# EAGLE design emonTx V4.0.3 (EAGLE 9.6.2)
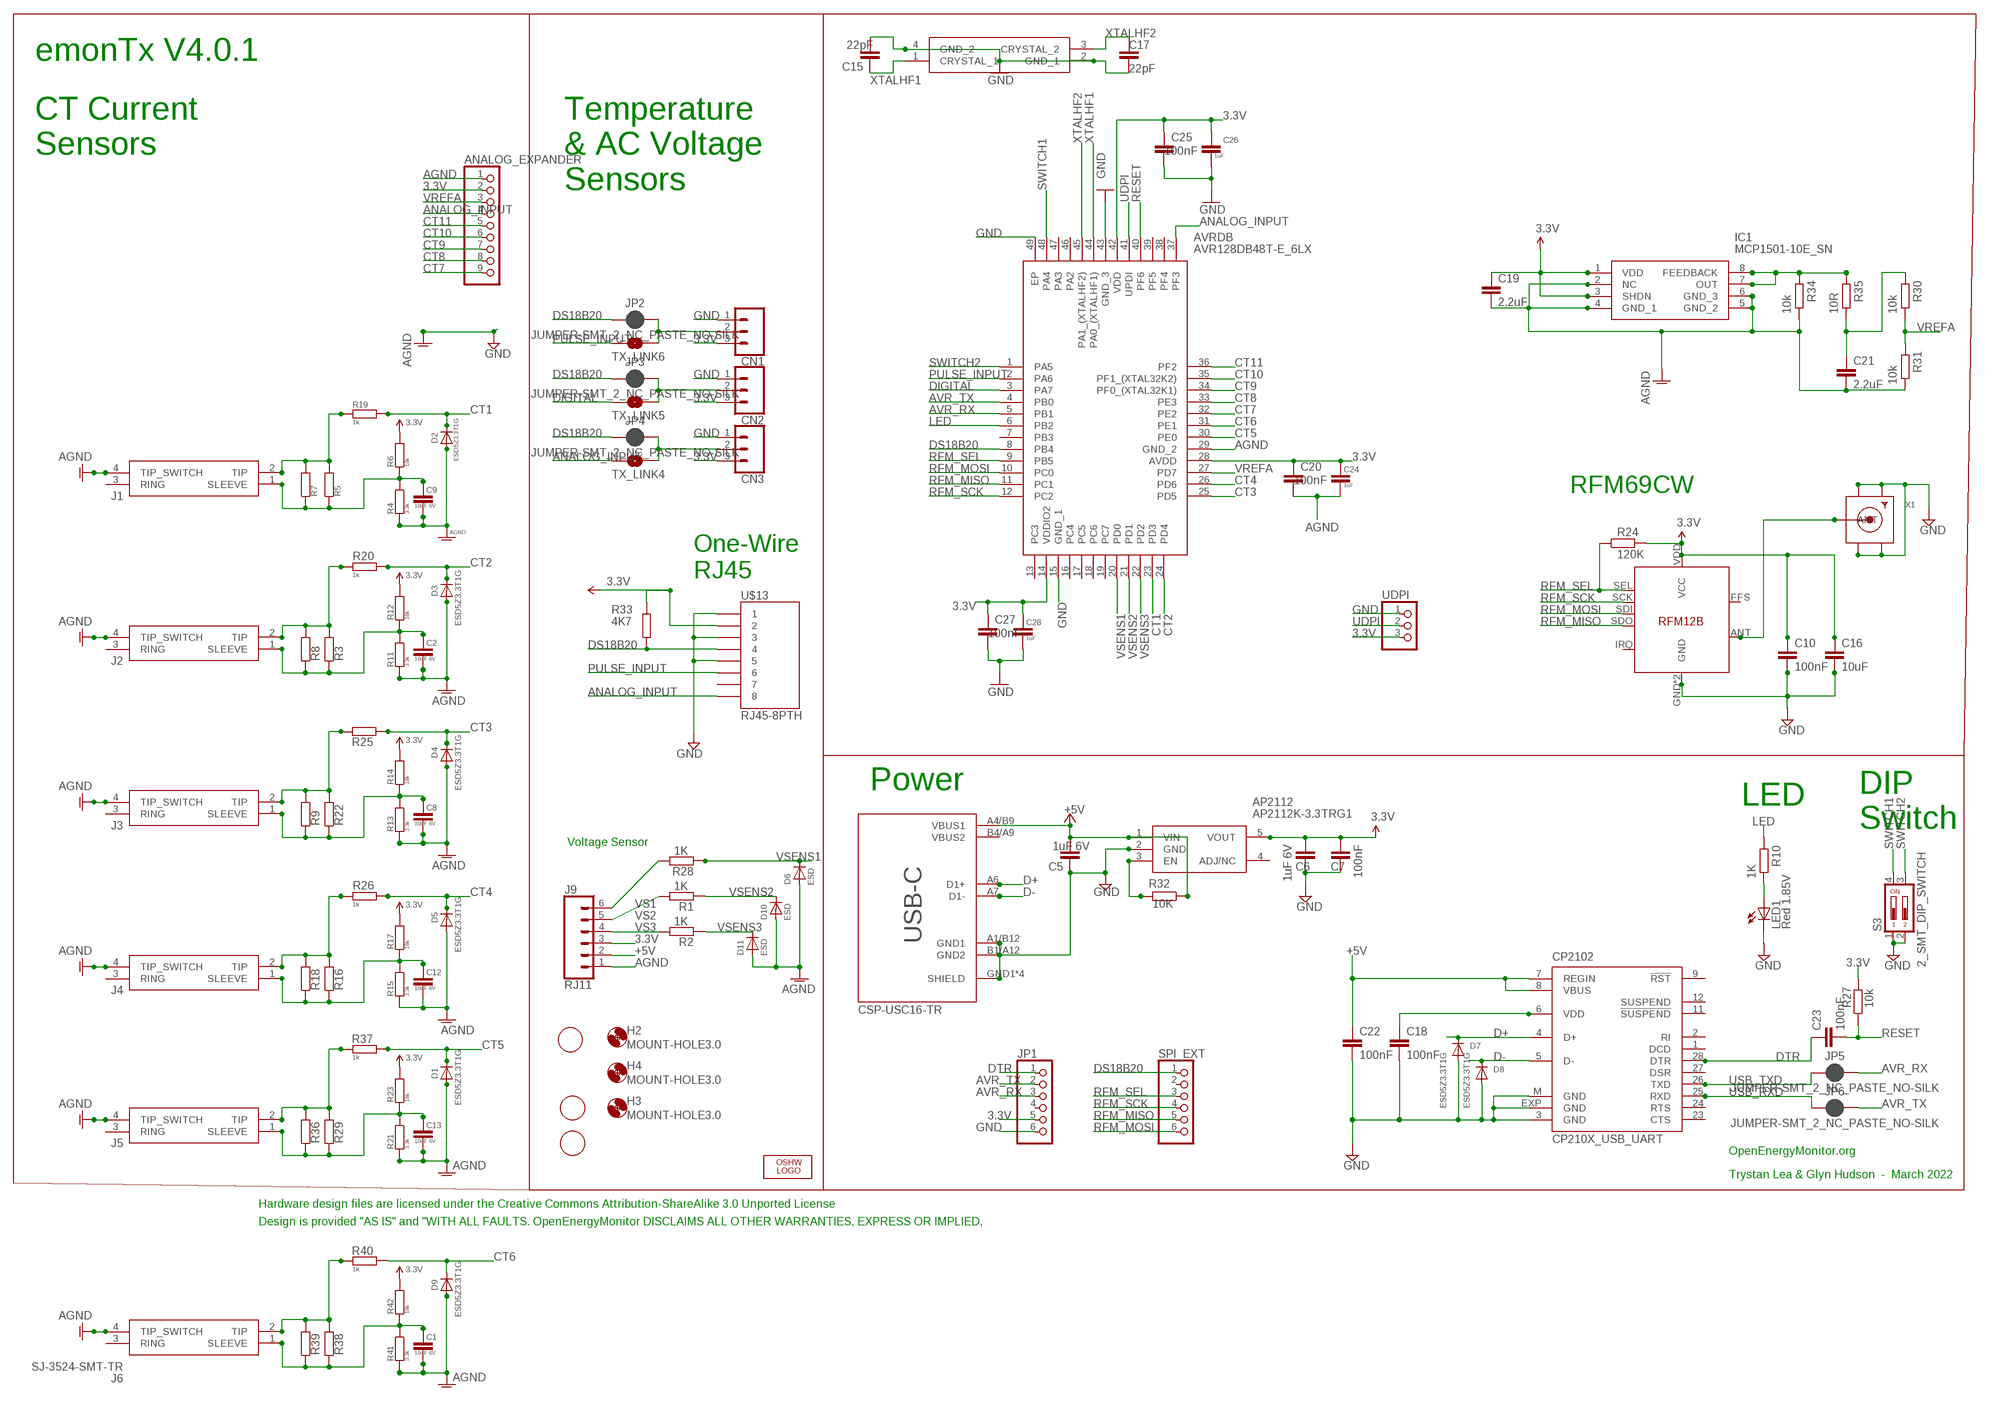
[diagram p0: schematic, sheet 1]

## Parts
ANALOG_EXPANDER  PINHD-1X9  [1X09-BIG]
AP2112  AP2112K-3.3TRG1  [SOT95P282X130-5N]
AVRDB  AVR128DB48T-E_6LX  [QFN40P600X600X90-49N]
C1  10uF 6V  C-EUC0603  [C0603]
C2  10uF 6V  C-EUC0603  [C0603]
C5  1uF 6V  C-EUC0603  [C0603]
C6  1uF 6V  C-EUC0603  [C0603]
C7  100nF  C-EUC0603  [C0603]
C8  10uF 6V  C-EUC0603  [C0603]
C9  10uF 6V  C-EUC0603  [C0603]
C10  100nF  C-EUC0603  [C0603]
C12  10uF 6V  C-EUC0603  [C0603]
C13  10uF 6V  C-EUC0603  [C0603]
C15  22pF  C-EUC0603  [C0603]
C16  10uF  C-EUC0603  [C0603]
C17  22pF  C-EUC0603  [C0603]
C18  100nF  CAP0603-CAP  [0603-CAP]
C19  2.2uF  C-EUC0603  [C0603]
C20  100nF  C-EUC0603  [C0603]
C21  2.2uF  C-EUC0603  [C0603]
C22  100nF  CAP0603-CAP  [0603-CAP]
C23  100nF  C-EUC0603  [C0603]
C24  1uF  C-EUC0603  [C0603]
C25  100nF  C-EUC0603  [C0603]
C26  1uF  C-EUC0603  [C0603]
C27  100nF  C-EUC0603  [C0603]
C28  1uF  C-EUC0603  [C0603]
CN1  CONN_03SCREW  [SCREWTERMINAL-3.5MM-3]
CN2  CONN_03SCREW  [SCREWTERMINAL-3.5MM-3]
CN3  CONN_03SCREW  [SCREWTERMINAL-3.5MM-3]
CP2102  CP210X_USB_UART  [MLP28]
D1  ESD5Z3.3T1G  DIODESOD-523  [SOD-523]
D2  ESD5Z3.3T1G  DIODESOD-523  [SOD-523]
D3  ESD5Z3.3T1G  DIODESOD-523  [SOD-523]
D4  ESD5Z3.3T1G  DIODESOD-523  [SOD-523]
D5  ESD5Z3.3T1G  DIODESOD-523  [SOD-523]
D6  ESD  DIODESOD-523  [SOD-523]
D7  ESD5Z3.3T1G  DIODESOD-523  [SOD-523]
D8  ESD5Z3.3T1G  DIODESOD-523  [SOD-523]
D9  ESD5Z3.3T1G  DIODESOD-523  [SOD-523]
D10  ESD  DIODESOD-523  [SOD-523]
D11  ESD  DIODESOD-523  [SOD-523]
H2  MOUNT-HOLE3.0  [3,0]
H3  MOUNT-HOLE3.0  [3,0]
H4  MOUNT-HOLE3.0  [3,0]
IC1  MCP1501-10E_SN  [SOIC127P600X175-8N]
J1  SJ-3524-SMT-TR  [SJ-3524-SMT-TR]
J2  SJ-3524-SMT-TR  [SJ-3524-SMT-TR]
J3  SJ-3524-SMT-TR  [SJ-3524-SMT-TR]
J4  SJ-3524-SMT-TR  [SJ-3524-SMT-TR]
J5  SJ-3524-SMT-TR  [SJ-3524-SMT-TR]
J6  SJ-3524-SMT-TR  [SJ-3524-SMT-TR]
J9  RJ11  RJ11-6  [RJ11-6]
JP1  PINHD-1X6  [1X06]
JP2  JUMPER-SMT_2_NC_PASTE_NO-SILK  [SMT-JUMPER_2_NC_PASTE_NO-SILK]
JP3  JUMPER-SMT_2_NC_PASTE_NO-SILK  [SMT-JUMPER_2_NC_PASTE_NO-SILK]
JP4  JUMPER-SMT_2_NC_PASTE_NO-SILK  [SMT-JUMPER_2_NC_PASTE_NO-SILK]
JP5  JUMPER-SMT_2_NC_PASTE_NO-SILK  [SMT-JUMPER_2_NC_PASTE_NO-SILK]
JP6  JUMPER-SMT_2_NC_PASTE_NO-SILK  [SMT-JUMPER_2_NC_PASTE_NO-SILK]
LED1  Red 1.85V  LEDCHIP-LED0805  [CHIP-LED0805]
LOGO1  OSHW_LOGO_6MILX0200-NT  [OSHW_6X200_NOTEXT]
R1  1K  R-EU_R0603  [R0603]
R2  1K  R-EU_R0603  [R0603]
R3  R-EU_0204/7  [0204/7]
R4  3.3k  R-EU_R0603  [R0603]
R5  R-EU_0204/7  [0204/7]
R6  18k  R-EU_R0603  [R0603]
R7  R-EU_R1206  [R1206]
R8  R-EU_R1206  [R1206]
R9  R-EU_R1206  [R1206]
R10  1K  R-EU_R0603  [R0603]
R11  3.3k  R-EU_R0603  [R0603]
R12  18k  R-EU_R0603  [R0603]
R13  3.3k  R-EU_R0603  [R0603]
R14  18k  R-EU_R0603  [R0603]
R15  3.3k  R-EU_R0603  [R0603]
R16  R-EU_0204/7  [0204/7]
R17  18k  R-EU_R0603  [R0603]
R18  R-EU_R1206  [R1206]
R19  1k  R-EU_R0603  [R0603]
R20  1k  R-EU_R0603  [R0603]
R21  3.3k  R-EU_R0603  [R0603]
R22  R-EU_0204/7  [0204/7]
R23  18k  R-EU_R0603  [R0603]
R24  120K  R-EU_R0603  [R0603]
R25  1k  R-EU_R0603  [R0603]
R26  1k  R-EU_R0603  [R0603]
R27  10k  R-EU_R0603  [R0603]
R28  1K  R-EU_R0603  [R0603]
R29  R-EU_0204/7  [0204/7]
R30  10k  R-EU_R0603  [R0603]
R31  10k  R-EU_R0603  [R0603]
R32  10K  R-EU_R0603  [R0603]
R33  4K7  R-EU_R0603  [R0603]
R34  10k  R-EU_R0603  [R0603]
R35  10R  R-EU_R0603  [R0603]
R36  R-EU_R1206  [R1206]
R37  1k  R-EU_R0603  [R0603]
R38  R-EU_0204/7  [0204/7]
R39  R-EU_R1206  [R1206]
R40  1k  R-EU_R0603  [R0603]
R41  3.3k  R-EU_R0603  [R0603]
R42  18k  R-EU_R0603  [R0603]
S3  2_SMT_DIP_SWITCH  [DIP_SWITCH_SMT]
SPI_EXT  PINHD-1X6  [1X06]
TX_LINK4  SOLDERJUMPERNC  [SJ_2S]
TX_LINK5  SOLDERJUMPERNC  [SJ_2S]
TX_LINK6  SOLDERJUMPERNC  [SJ_2S]
U$4  FIDUCIAL  [FIDUCIAL_1MM]
U$5  FIDUCIAL  [FIDUCIAL_1MM]
U$7  FIDUCIAL  [FIDUCIAL_1MM]
U$13  RJ45-8PTH  [RJ45-8]
U$14  RFM12B  [RFM12B]
UDPI  PINHD-1X3  [1X03]
USB-C  CSP-USC16-TR  [USB-C]
X1  SMACONNECTOR  [SMA90_DIP]
XTAL  MCSJK-7U-12.00-12-10-80-B-10  [MCSJK7U1200121080B10]

## Nets
3.3V: ANALOG_EXPANDER.2 AP2112.5(VOUT) AVRDB.14(VDDIO2) AVRDB.28(AVDD) AVRDB.42(VDD) C6.2 C7.2 C10.1 C16.1 C19.1 C20.1 C24.1 C25.1 C26.1 C27.1 C28.1 CN1.3 CN2.3 CN3.3 IC1.1(VDD) IC1.3(SHDN) J9.3 JP1.5 R6.2 R12.2 R14.2 R17.2 R23.2 R24.2 R27.2 R33.1 R42.2 U$13.2 U$14.VDD(VCC) UDPI.3
+5V [power]: AP2112.1(VIN) C5.2 C22.1 CP2102.7(REGIN) CP2102.8(VBUS) J9.2 R32.1 USB-C.A4/B9(VBUS1)
AGND [gnd]: ANALOG_EXPANDER.1 AVRDB.29(GND_2) C1.2 C2.2 C8.2 C9.2 C12.2 C13.2 C19.2 C20.2 C21.2 C24.2 D1.A D2.A D3.A D4.A D5.A D6.A D9.A D10.A D11.A IC1.2(NC) IC1.4(GND_1) IC1.5(GND_2) IC1.6(GND_3) J1.4(TIP_SWITCH) J2.4(TIP_SWITCH) J3.4(TIP_SWITCH) J4.4(TIP_SWITCH) J5.4(TIP_SWITCH) J6.4(TIP_SWITCH) J9.1 R4.2 R11.2 R13.2 R15.2 R21.2 R31.1 R34.1 R41.2
ANALOG_INPUT: ANALOG_EXPANDER.4 AVRDB.37(PF3) TX_LINK4.1 U$13.8
AVR_RX: AVRDB.5(PB1) JP1.3 JP5.2
AVR_TX: AVRDB.4(PB0) JP1.2 JP6.2
CT1: AVRDB.23(PD3) D2.K(C) R19.2
CT2: AVRDB.24(PD4) D3.K(C) R20.2
CT3: AVRDB.25(PD5) D4.K(C) R25.1
CT4: AVRDB.26(PD6) D5.K(C) R26.2
CT5: AVRDB.30(PE0) D1.K(C) R37.2
CT6: AVRDB.31(PE1) D9.K(C) R40.2
CT7: ANALOG_EXPANDER.9 AVRDB.32(PE2)
CT8: ANALOG_EXPANDER.8 AVRDB.33(PE3)
CT9: ANALOG_EXPANDER.7 AVRDB.34(PF0_(XTAL32K1))
CT10: ANALOG_EXPANDER.6 AVRDB.35(PF1_(XTAL32K2))
CT11: ANALOG_EXPANDER.5 AVRDB.36(PF2)
D+: CP2102.4(D+) D7.K(C) USB-C.A6(D1+)
D-: CP2102.5(D-) D8.K(C) USB-C.A7(D1-)
DIG1: U$14.ANT X1.ANTENNA(ANT)
DIGITAL: AVRDB.3(PA7) TX_LINK5.1
DS18B20: AVRDB.8(PB4) JP2.1 JP3.1 JP4.1 R33.2 SPI_EXT.1 U$13.4
DTR: C23.1 CP2102.28(DTR) JP1.1
GND [gnd]: AP2112.2(GND) AVRDB.15(GND_1) AVRDB.43(GND_3) AVRDB.49(EP) C5.1 C6.1 C7.1 C10.2 C15.2 C16.2 C17.2 C18.2 C22.2 C25.2 C26.2 C27.2 C28.2 CN1.1 CN2.1 CN3.1 CP2102.3(GND) CP2102.EXP(GND) CP2102.M(GND) D7.A D8.A JP1.6 LED1.C S3.1 S3.2 U$13.1 U$13.3 U$13.5 U$14.GND U$14.P$12(GND) UDPI.1 USB-C.A1/B12(GND1) USB-C.B1/A12(GND2) USB-C.GND1(SHIELD) USB-C.GND2(SHIELD) USB-C.GND3(SHIELD) USB-C.GND4(SHIELD) X1.GND1 X1.GND2 X1.GND3 X1.GND4 XTAL.2(GND_1) XTAL.4(GND_2) ; supply symbol labelled AGND
LED: AVRDB.6(PB2) R10.2
N$1: AP2112.3(EN) R32.2
N$2: J6.2(TIP) R38.2 R39.2 R40.1
N$3: J3.2(TIP) R9.2 R22.2 R25.2
N$4: C18.1 CP2102.6(VDD)
N$5: C1.1 J6.1(SLEEVE) R38.1 R39.1 R41.1 R42.1
N$6: C21.1 R30.2 R35.1
N$8: J4.2(TIP) R16.2 R18.2 R26.1
N$10: J1.2(TIP) R5.2 R7.2 R19.1
N$11: C9.1 J1.1(SLEEVE) R4.1 R5.1 R6.1 R7.1
N$12: J5.2(TIP) R29.2 R36.2 R37.1
N$13: J2.2(TIP) R3.2 R8.2 R20.1
N$18: CN1.2 JP2.2 TX_LINK6.2
N$19: CN2.2 JP3.2 TX_LINK5.2
N$21: CN3.2 JP4.2 TX_LINK4.2
N$24: C2.1 J2.1(SLEEVE) R3.1 R8.1 R11.1 R12.1
N$25: C8.1 J3.1(SLEEVE) R9.1 R13.1 R14.1 R22.1
N$26: C12.1 J4.1(SLEEVE) R15.1 R16.1 R17.1 R18.1
N$27: IC1.7(OUT) IC1.8(FEEDBACK) R34.2 R35.2
N$28: C13.1 J5.1(SLEEVE) R21.1 R23.1 R29.1 R36.1
N$41: LED1.A R10.1
PULSE_INPUT: AVRDB.2(PA6) TX_LINK6.1 U$13.6
RESET: AVRDB.40(PF6) C23.2 R27.1
RFM_MISO: AVRDB.11(PC1) SPI_EXT.5 U$14.SDO
RFM_MOSI: AVRDB.10(PC0) SPI_EXT.6 U$14.SDI
RFM_SCK: AVRDB.12(PC2) SPI_EXT.4 U$14.SCK
RFM_SEL: AVRDB.9(PB5) R24.1 SPI_EXT.3 U$14.SEL
SWITCH1: AVRDB.48(PA4) S3.4
SWITCH2: AVRDB.1(PA5) S3.3
UDPI: AVRDB.41(UPDI) UDPI.2
USB_RXD: CP2102.25(RXD) JP6.1
USB_TXD: CP2102.26(TXD) JP5.1
VREFA: ANALOG_EXPANDER.3 AVRDB.27(PD7) R30.1 R31.2
VS1: J9.6 R28.2
VS2: J9.5 R1.2
VS3: J9.4 R2.2
VSENS1: AVRDB.20(PD0) D6.K(C) R28.1
VSENS2: AVRDB.21(PD1) D10.K(C) R1.1
VSENS3: AVRDB.22(PD2) D11.K(C) R2.1
XTALHF1: AVRDB.44(PA0_(XTALHF1)) C15.1 XTAL.1(CRYSTAL_1)
XTALHF2: AVRDB.45(PA1_(XTALHF2)) C17.1 XTAL.3(CRYSTAL_2)
Unconnected: AP2112.4(ADJ/NC) AVRDB.7(PB3) AVRDB.13(PC3) AVRDB.16(PC4) AVRDB.17(PC5) AVRDB.18(PC6) AVRDB.19(PC7) AVRDB.38(PF4) AVRDB.39(PF5) AVRDB.46(PA2) AVRDB.47(PA3) CP2102.1(DCD) CP2102.2(RI) CP2102.9(!RST) CP2102.11(!SUSPEND) CP2102.12(SUSPEND) CP2102.23(CTS) CP2102.24(RTS) CP2102.27(DSR) J1.3(RING) J2.3(RING) J3.3(RING) J4.3(RING) J5.3(RING) J6.3(RING) JP1.4 SPI_EXT.2 U$13.7 U$14.FFS U$14.IRQ USB-C.B4/A9(VBUS2)

## Notes on the sheet
- emonTx V4.0.1
- CT Current 
  Sensors
- Temperature 
  & AC Voltage
  Sensors
- RFM69CW
- One-Wire
  RJ45
- Power
- LED
- DIP
  Switch
- Voltage Sensor
- OpenEnergyMonitor.org
- Trystan Lea & Glyn Hudson  -  March 2022
- Hardware design files are licensed under the Creative Commons Attribution-ShareAlike 3.0 Unported License
- Design is provided "AS IS" and "WITH ALL FAULTS. OpenEnergyMonitor DISCLAIMS ALL OTHER WARRANTIES, EXPRESS OR IMPLIED,

## Library data of the parts
ANALOG_EXPANDER = adafruit:PINHD-1X9: Pin header 1x10 0.1" spacing With round pins
AP2112 = AP2112K-3.3TRG1:AP2112K-3.3TRG1: 600mA 3.3V LDO Regulator Enable SOT23-5 DiodesZetex AP2112K-3.3TRG1, LDO Voltage Regulator, 3.3 V +/-1.5%, 2.5 6 Vin, 5-Pin SOT-23 Source: Datasheet <http://uk.rs-online.com/web/p/products/8283509>; ARROW_PART_NUMBER: AP2112K-3.3TRG1; ARROW_PRICE-STOCK: https://www.arrow.com/en/products/ap2112k-3.3trg1/diodes-incorporated?region=nac; DESCRIPTION: 600mA 3.3V LDO Regulator Enable SOT23-5 DiodesZetex AP2112K-3.3TRG1, LDO Voltage Regulator, 3.3 V +/-1.5%, 2.5 6 Vin, 5-Pin SOT-23; HEIGHT: 1.3mm; MANUFACTURER_NAME: Diodes Inc.; MANUFACTURER_PART_NUMBER: AP2112K-3.3TRG1; MOUSER_PART_NUMBER: 621-AP2112K-3.3TRG1; MOUSER_PRICE-STOCK: https://www.mouser.co.uk/ProductDetail/Diodes-Incorporated/AP2112K-33TRG1?qs=x6A8l6qLYDDPYHosCdzh%2FA%3D%3D
AVRDB = AVR128DB48T-E_6LX:AVR128DB48T-E_6LX: IC MCU 8BIT 128KB FLASH 48VQFN Source: Datasheet <https://4donline.ihs.com/images/VipMasterIC/IC/MCHP/MCHP-S-A0010410415/MCHP-S-A0011111973-1.pdf?hkey=6D3A4C79FDBF58556ACFDE234799DDF0>; DESCRIPTION: IC MCU 8BIT 128KB FLASH 48VQFN; HEIGHT: 0.9mm; MANUFACTURER_NAME: Microchip; MANUFACTURER_PART_NUMBER: AVR128DB48T-E/6LX; MOUSER_PART_NUMBER: 579-VR128DB48T-E/6LX; MOUSER_PRICE-STOCK: https://www.mouser.co.uk/ProductDetail/Microchip-Technology/AVR128DB48T-E-6LX?qs=vmHwEFxEFR%252BvecSHjxOfmQ%3D%3D
C1 C2 C5-C9 C12 C13 C15 C17 C20 C24-C28 = resistor:C-EU: CAPACITOR, European symbol
C10 C16 C19 C21 C23 = rcl:C-EU: CAPACITOR, European symbol
C18 C22 = SparkFun:CAP: Capacitor Standard 0603 ceramic capacitor, and 0.1" leaded capacitor.
CN1-CN3 = SparkFun-Connectors:CONN_03: Multi connection point. Often used as Generic Header-pin footprint for 0.1 inch spaced/style header connections On any of the 0.1 inch spaced packages, you can populate with these: Break Away Headers - Straight <https://www.sparkfun.com/products/116> (PRT-00116) Break Away Male Headers - Right Angle <https://www.sparkfun.com/products/553> (PRT-00553) Female Headers <https://www.sparkfun.com/products/115> (PRT-00115) Break Away Headers - Machine Pin <https://www.sparkfun.com/products/117> (PRT-00117) Break Away Female Headers - Swiss Machine Pin <https://www.sparkfun.com/products/743> (PRT-00743) Stackable Header - 3 Pin (Female, 0.1") <https://www.sparkfun.com/products/13875> (PRT-13875) For SCREWTERMINALS and SPRING TERMINALS visit here: Screw Terimnals on SparkFun.com <https://www.sparkfun.com/search/results?term=Screw+Terminals> (5mm/3.5mm/2.54mm spacing) This device is also useful as a general connection point to wire up your design to another part of your project. Our various solder wires solder well into these plated through hole pads. Hook-Up Wire - Assortment (Stranded, 22 AWG) <https://www.sparkfun.com/products/11375> (PRT-11375) Hook-Up Wire - Assortment (Solid Core, 22 AWG) <https://www.sparkfun.com/products/11367> (PRT-11367) View the entire wire category on our website here <https://www.sparkfun.com/categories/141> Special notes: Molex polarized connector foot print use with SKU : PRT-08232 with associated crimp pins and housings.; PROD_ID: CONN-08288; SF_ID: PRT-08235
CP2102 = SparkFun-DigitalIC:CP210X_USB_UART: Single-Chip USB to UART Bridge Source: www.silabs.com .. CP2101.pdf / cp2102.pdf. Spark Fun Electronics SKU : COM-00310
D1-D11 = microbuilder:DIODE: Diode SMA Model Volts Amps Type Vf Vr Digikey # Notes SSA34-E3 40V 3A Schottky 480mV @ 3A 200uA @ 40V SSA34-E3/61TGITR-ND CDBA120-G 20V 1A Schottky 500mV @ 1A 500uA @ 20V 641-1014-6-ND REEL MBRA210 10V 2A Schottky 350mV @ 2A 700uA @ 10V MBRA210LT3 SOD-123 Model Volts Amps Type Vf Vr Order # Notes BAT54T1G 30V 200mA Schottky 800mV @ 200mA 2uA @ 25V BAT54T1GOSTR-ND B0530W 30V 500mA Schottky 430mV @ 500mA 130uA @ 30V B0530W-FDICT-ND REEL MBR120 1A 20V Schottky 340mV @ 1A MBR120VLSFT1GOSCT-ND SOD-323 Model Volts Amps Type Vf Vr Order # Notes PMEG2005EJ 20V 500mA Schottky 355mV @ 500mA 568-4110-1-ND ZLLS410 10V 570mA Schottky 380mV @ 570mA ZLLS410CT-ND 1N4148WS 75V 150mA Silicon/Simple 1V 1N4148WSFSCT-ND REEL SOD-523 Model Volts Amps Type Vf Vr Order # Notes BAT54XV2 30V 200mA Schottky 0.8V @ 100mA BAT54XV2CT-ND TB751S 30V 30mA Schottky RB751S-40TE61CT-ND SOT23-R/W (R = Solder Paste/Reflow Ovens, W = Hand-Soldering) Model Volts Amps Type Vf Vr Order # Notes BAT54FILM 40V 300mA Schottky 497-7162-1-ND
H2-H4 = holes:MOUNT-HOLE: MOUNTING HOLE with drill center marker
IC1 = MCP1501-10E_SN:MCP1501-10E_SN: MICROCHIP - MCP1501-10E/SN - VOLTAGE REF, SERIES, 1.024V, NSOIC-8 Source: Datasheet <http://www.farnell.com/datasheets/2015662.pdf>; ARROW_PART_NUMBER: MCP1501-10E/SN; ARROW_PRICE-STOCK: https://www.arrow.com/en/products/mcp1501-10esn/microchip-technology; DESCRIPTION: MICROCHIP - MCP1501-10E/SN - VOLTAGE REF, SERIES, 1.024V, NSOIC-8; HEIGHT: 1.75mm; MANUFACTURER_NAME: Microchip; MANUFACTURER_PART_NUMBER: MCP1501-10E/SN; MOUSER_PART_NUMBER: 579-MCP1501-10E/SN; MOUSER_PRICE-STOCK: https://www.mouser.co.uk/ProductDetail/Microchip-Technology/MCP1501-10E-SN?qs=BA62vJVifGrukY%252BvRXgfwQ%3D%3D
J1-J6 = SJ-3524-SMT-TR:SJ-3524-SMT-TR: Phone Connectors Audio Jacks Source: Datasheet <https://datasheet.datasheetarchive.com/originals/distributors/Datasheets-DGA1/151896.pdf>; ARROW_PART_NUMBER: SJ-3524-SMT-TR; ARROW_PRICE-STOCK: https://www.arrow.com/en/products/sj-3524-smt-tr/cui-devices?region=nac; DESCRIPTION: Phone Connectors Audio Jacks; HEIGHT: mm; MANUFACTURER_NAME: CUI Inc.; MANUFACTURER_PART_NUMBER: SJ-3524-SMT-TR; MOUSER_PART_NUMBER: 490-SJ-3524-SMT-TR; MOUSER_PRICE-STOCK: https://www.mouser.co.uk/ProductDetail/CUI-Devices/SJ-3524-SMT-TR?qs=WyjlAZoYn50%252B7OcNbxvx%252BA%3D%3D
J9 = SparkFun-Connectors:RJ11-6: RJ11 Jack - 6 pin Commonly found on CAT3 devices and some Microchip programmers. Here is the connector we sell at SparkFun: RJ11 6-Pin Connector <https://www.sparkfun.com/products/132> (PRT-00132) Datasheet <http://www.sparkfun.com/datasheets/Prototyping/Connectors/RJ11-Datasheet.pdf> It is used on this SparkFun product: SparkFun Weather Shield <https://www.sparkfun.com/products/12081> (DEV-12081) Weather Meters <https://www.sparkfun.com/products/8942> (SEN-08942); PROD_ID: CONN-08590; SF_ID: PRT-00132
JP1 SPI_EXT = adafruit:PINHD-1X6: PIN HEADER
JP2-JP6 = SparkFun-Jumpers:JUMPER-SMT_2_NC_PASTE: Normally closed solder jumper This jumper has an aperture in the stencil to allow solder paste to bridge the split in the wire so it's normally closed (NC). Wick off the solder to open the connection. Reapply solder to reclose the connection.
LED1 = adafruit:LED: LED OSRAM: - CHIPLED LG R971, LG N971, LY N971, LG Q971, LY Q971, LO R971, LY R971 LH N974, LH R974 LS Q976, LO Q976, LY Q976 LO Q996 - Hyper CHIPLED LW Q18S LB Q993, LB Q99A, LB R99A - SideLED LS A670, LO A670, LY A670, LG A670, LP A670 LB A673, LV A673, LT A673, LW A673 LH A674 LY A675 LS A676, LA A676, LO A676, LY A676, LW A676 LS A679, LY A679, LG A679 - Hyper Micro SIDELED® LS Y876, LA Y876, LO Y876, LY Y876 LT Y87S - SmartLED LW L88C, LW L88S LB L89C, LB L89S, LG L890 LS L89K, LO L89K, LY L89K LS L896, LA L896, LO L896, LY L896 - TOPLED LS T670, LO T670, LY T670, LG T670, LP T670 LSG T670, LSP T670, LSY T670, LOP T670, LYG T670 LG T671, LOG T671, LSG T671 LB T673, LV T673, LT T673, LW T673 LH T674 LS T676, LA T676, LO T676, LY T676, LB T676, LH T676, LSB T676, LW T676 LB T67C, LV T67C, LT T67C, LS T67K, LO T67K, LY T67K, LW E67C LS E67B, LA E67B, LO E67B, LY E67B, LB E67C, LV E67C, LT E67C LW T67C LS T679, LY T679, LG T679 LS T770, LO T770, LY T770, LG T770, LP T770 LB T773, LV T773, LT T773, LW T773 LH T774 LS E675, LA E675, LY E675, LS T675 LS T776, LA T776, LO T776, LY T776, LB T776 LHGB T686 LT T68C, LB T68C - Hyper Mini TOPLED® LB M676 - Mini TOPLED Santana® LG M470 LS M47K, LO M47K, LY M47K Source: http://www.osram.convergy.de/
LOGO1 = ohw-logo:OSHW_LOGO_6MIL
R1-R42 = rcl:R-EU_: RESISTOR, European symbol
S3 = OpenEnergyMonitor:2_SMT_DIP_SWITCH: Multicomp MCEMR-02-T 2 throw SMT DIP switch, Farnell 1524005
TX_LINK4-TX_LINK6 = SparkFun:SOLDERJUMPER: Solder Jumper Standard SMD solder jumper. Used to automate production. Two varients : Normally Open and Normally Closed are the same, but have different paste layers. NC will have a large amount of paste and should jumper during reflow.
U$4 U$5 U$7 = adafruit:FIDUCIAL: For use by pick and place machines to calibrate the vision/machine, 1mm By microbuilder.eu
U$13 = SparkFun-Connectors:RJ45-8: RJ45 Jack Simple RJ45, 8-pin connection - connector for common Cat5, Cat5e, and Cat6 Ethernet cables. Footprint not yet proven in production. Connector sku is PRT-00643; Breakout PCB sku is BOB-00716.
U$14 = JeeParts:RFM12B
UDPI = adafruit:PINHD-1X3: PIN HEADER
USB-C = CSP-USC16-TR:CSP-USC16-TR: CSP-USC16-TR TOBY.CO.UK; MPN: CSP-USC16-TR
X1 = adafruit:SMACONNECTOR: SMA Connector 90° DIP SMA Connector, 50 Ohm (4UConnector: 07259)
XTAL = MCSJK-7U-12.00-12-10-80-B-10:MCSJK-7U-12.00-12-10-80-B-10: CRYSTAL, 12MHZ, 12PF, 3.2MM X 2.5MM Source: Datasheet <https://componentsearchengine.com/Datasheets/2/MCSJK-7U-12.00-12-10-80-B-10.pdf>; DESCRIPTION: CRYSTAL, 12MHZ, 12PF, 3.2MM X 2.5MM; HEIGHT: 0.8mm; MANUFACTURER_NAME: MULTICOMP; MANUFACTURER_PART_NUMBER: MCSJK-7U-12.00-12-10-80-B-10

## Net classes
0 default: width 0.203 mm, drill 0.6 mm, clearance 0.203 mm
1 power: width 0.305 mm, drill 0.6 mm, clearance 0.254 mm
2 gnd: width 0.254 mm, drill 0.6 mm, clearance 0.254 mm

## Board
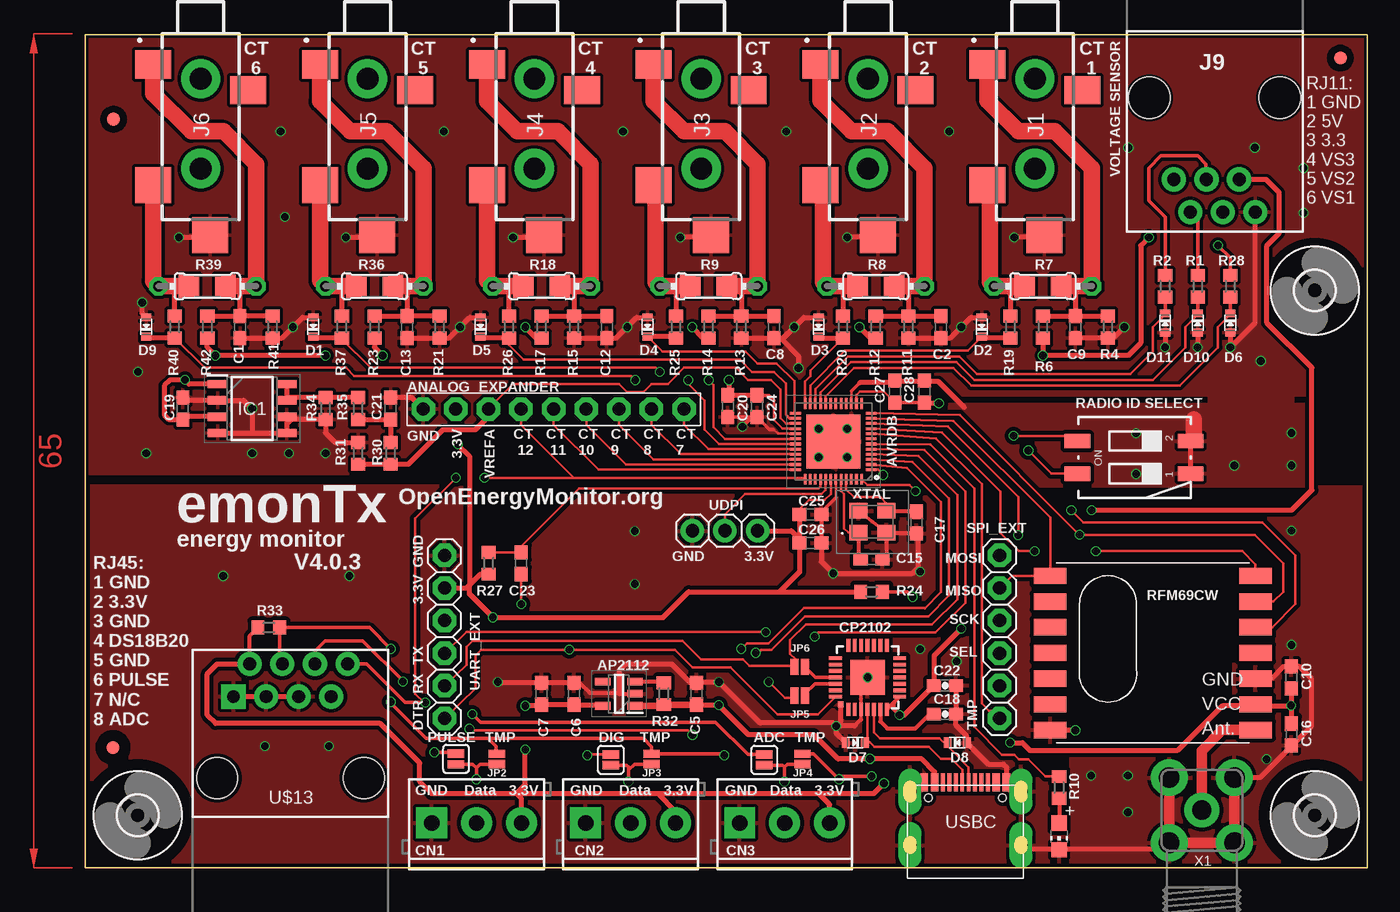
[diagram p1: board, top side]
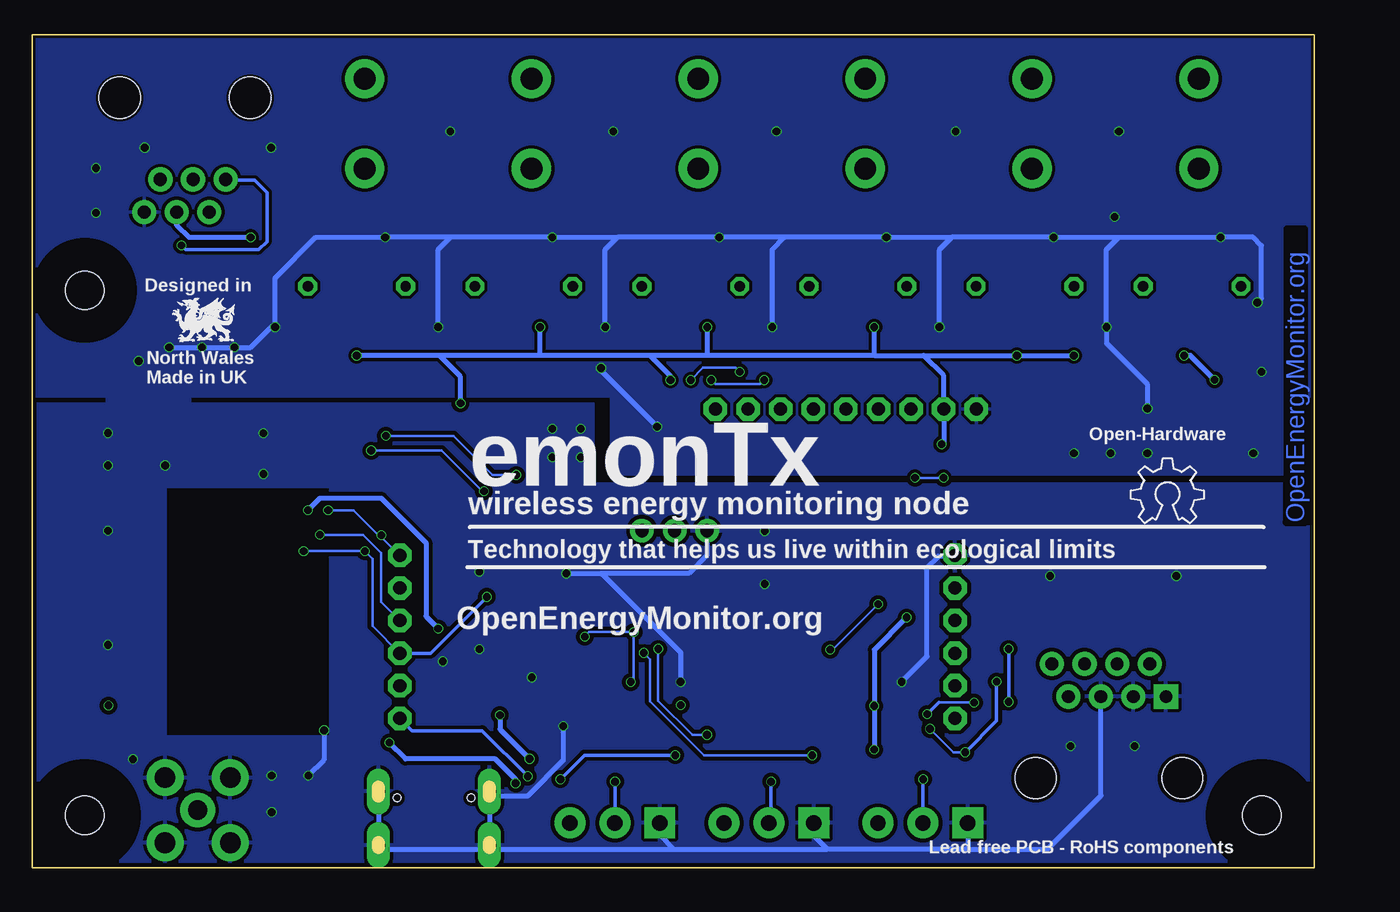
[diagram p2: board, bottom side, seen from below]

Size 99.9 x 64.91 mm. Coordinates in mm from the lower left corner, seen from the top.
Outline: 0,64.91 0,0 99.9,0 99.9,64.91 0,64.91
Copper layers (1*16): Top 0.035mm / dielectric 1.6mm / Bottom 0.035mm
Design rules "jlcpcb-2layers": minimum track width 5mil, minimum drill 0.3mm, track to track 5mil, track to pad 5mil, pad to pad 5mil, via to via 5mil, smd to smd 5mil, copper to edge 0.2mm, drill to drill 6mil, minimum pad ring 10mil, minimum via ring 3mil, stop-mask expansion 4mil, vias tented up to drill 0mil, thermal gap 10mil

### Footprints (pad centres in the part's own frame; a part is rotated, then mirrored left to right if it is on the bottom)
1X09-BIG = drill 1.016 pad 1.778 octagon: 1 -10.16,0; 2 -7.62,0; 3 -5.08,0; 4 -2.54,0; 5 0,0; 6 2.54,0; 7 5.08,0; 8 7.62,0; 9 10.16,0
SOT95P282X130-5N = smd 1.2 x 0.6: 1 -1.25,0.95; 2 -1.25,0; 3 -1.25,-0.95; 4 1.25,-0.95; 5 1.25,0.95
QFN40P600X600X90-49N = smd 0.85 x 0.2: 1 -2.95,2.2; 2 -2.95,1.8; 3 -2.95,1.4; 4 -2.95,1; 5 -2.95,0.6; 6 -2.95,0.2; 7 -2.95,-0.2; 8 -2.95,-0.6; 9 -2.95,-1; 10 -2.95,-1.4; 11 -2.95,-1.8; 12 -2.95,-2.2; 25 2.95,-2.2; 26 2.95,-1.8; 27 2.95,-1.4; 28 2.95,-1; 29 2.95,-0.6; 30 2.95,-0.2; 31 2.95,0.2; 32 2.95,0.6; 33 2.95,1; 34 2.95,1.4; 35 2.95,1.8; 36 2.95,2.2 | smd 0.2 x 0.85: 13 -2.2,-2.95; 14 -1.8,-2.95; 15 -1.4,-2.95; 16 -1,-2.95; 17 -0.6,-2.95; 18 -0.2,-2.95; 19 0.2,-2.95; 20 0.6,-2.95; 21 1,-2.95; 22 1.4,-2.95; 23 1.8,-2.95; 24 2.2,-2.95; 37 2.2,2.95; 38 1.8,2.95; 39 1.4,2.95; 40 1,2.95; 41 0.6,2.95; 42 0.2,2.95; 43 -0.2,2.95; 44 -0.6,2.95; 45 -1,2.95; 46 -1.4,2.95; 47 -1.8,2.95; 48 -2.2,2.95 | smd 4.2 x 4.2: 49 0,0
C0603 = smd 1.1 x 1: 1 -0.85,0; 2 0.85,0
0603-CAP = smd 1.1 x 1: 1 -0.85,0; 2 0.85,0
SCREWTERMINAL-3.5MM-3 = drill 1.2 pad 2.413 square: 1 0,0 | drill 1.2 pad 2.413: 2 3.5,0; 3 7,0
MLP28 = smd 1 x 0.3: 1 -2.5,1.5; 2 -2.5,1; 3 -2.5,0.5; 4 -2.5,0; 5 -2.5,-0.5; 6 -2.5,-1; 7 -2.5,-1.5; 15 2.5,-1.5; 16 2.5,-1; 17 2.5,-0.5; 18 2.5,0; 19 2.5,0.5; 20 2.5,1; 21 2.5,1.5 | smd 0.3 x 1: 8 -1.5,-2.5; 9 -1,-2.5; 10 -0.5,-2.5; 11 0,-2.5; 12 0.5,-2.5; 13 1,-2.5; 14 1.5,-2.5; 22 1.5,2.5; 23 1,2.5; 24 0.5,2.5; 25 0,2.5; 26 -0.5,2.5; 27 -1,2.5; 28 -1.5,2.5 | smd 2.7 x 2.7: EXP 0,0 | smd 0.435 x 0.435: M -2.103,2.103
SOD-523 = smd 0.8 x 0.6: A 0,-0.75; K 0,0.75
3,0 = hole 3: 0,0
SOIC127P600X175-8N = smd 1.5 x 0.65: 1 -2.7,1.905; 2 -2.7,0.635; 3 -2.7,-0.635; 4 -2.7,-1.905; 5 2.7,-1.905; 6 2.7,-0.635; 7 2.7,0.635; 8 2.7,1.905
SJ-3524-SMT-TR = smd 2.2 x 2.8: 1 2.4,-6.7; 3 4.4,0.7 | smd 2.8 x 2.8: 2 11.8,-6.7; 4 15.7,-2.25 | drill 1.7 pad 2.55: 5 3.5,-3; 6 10.5,-3
RJ11-6 = drill 1.016 pad 1.88: 1 -3.175,8.89; 2 -1.905,6.35; 3 -0.635,8.89; 4 0.635,6.35; 5 1.905,8.89; 6 3.175,6.35 | hole 3.251: -5.08,0; 5.08,0
1X06 = drill 1.016 octagon: 1 -6.35,0; 2 -3.81,0; 3 -1.27,0; 4 1.27,0; 5 3.81,0; 6 6.35,0
SMT-JUMPER_2_NC_PASTE_NO-SILK = smd 0.635 x 1.27: 1 -0.406,0; 2 0.406,0
CHIP-LED0805 = smd 1.2 x 1.2: A 0,-1.05; C 0,1.05
R0603 = smd 1 x 1.1: 1 -0.85,0; 2 0.85,0
0204/7 = drill 0.813 octagon: 1 -3.81,0; 2 3.81,0
R1206 = smd 1.6 x 1.803: 1 -1.422,0; 2 1.422,0
DIP_SWITCH_SMT = smd 1.1 x 2: 1 -1.27,-4.215; 2 1.27,-4.215; 3 1.27,4.615; 4 -1.27,4.615
SJ_2S = smd 0.635 x 1.27: 1 -0.412,0; 2 0.412,0
FIDUCIAL_1MM = smd 1 x 1: 1 0,0
RJ45-8 = drill 1 pad 1.88 square: 1 -4.445,6.35 | drill 1 pad 1.88: 2 -3.175,8.89; 3 -1.905,6.35; 4 -0.635,8.89; 5 0.635,6.35; 6 1.905,8.89; 7 3.175,6.35; 8 4.445,8.89 | hole 3.2: -5.715,0; 5.715,0
RFM12B = smd 2.54 x 1.27: ANT 8,-6; FFS -8,2; GND 8,-2; IRQ -8,4; P$8 -8,0; P$9 -8,-2; P$10 -8,-4; P$12 -8,-6; P$16 8,0; SCK 8,4; SDI 8,2; SDO -8,6; SEL 8,6; VDD 8,-4
1X03 = drill 1.016: 1 -2.54,0; 2 0,0; 3 2.54,0
USB-C = smd 0.6 x 1.4: A1/B12 -3.2,0.7; A4/B9 -2.4,0.7; B1/A12 3.2,0.7; B4/A9 2.4,0.7 | smd 0.3 x 1.4: A5 -1.25,0.7; A6 -0.25,0.7; A7 0.25,0.7; A8 1.25,0.7; B5 1.75,0.7; B6 0.75,0.7; B7 -0.75,0.7; B8 -1.75,0.7 | drill 1 pad 1.2 long: GND1 -4.32,0; GND2 4.33,0; GND3 4.33,-4.18; GND4 -4.32,-4.18 | hole 0.6: -2.89,-0.5; 2.89,-0.5
SMA90_DIP = drill 1.5 pad 2.54: ANTENNA 0,0 | drill 1.6 pad 2.54: GND1 -2.54,2.54; GND2 2.54,2.54; GND3 -2.54,-2.54; GND4 2.54,-2.54
MCSJK7U1200121080B10 = smd 1.4 x 1.2: 1 -1.1,-0.85; 2 1.1,-0.85; 3 1.1,0.85; 4 -1.1,0.85

### Placement (x,y rotation side)
ANALOG_EXPANDER  36.5,35.75 0 top
AP2112  41.59,13.57 180 top
AVRDB  58.29,33.23 180 top
C1  12.06,42.15 270 top
C2  66.67,42.15 270 top
C5  47.62,13.57 270 top
C6  38.1,13.57 270 top
C7  35.56,13.57 270 top
C8  53.66,42.15 270 top
C9  77.15,42.15 270 top
C10  93.98,14.84 90 top
C12  40.64,42.15 270 top
C13  25.08,42.15 270 top
C15  61.28,24.05 0 top
C16  93.98,10.4 270 top
C17  64.77,26.91 270 top
C18  66.99,11.99 0 top
C19  7.62,35.8 90 top
C20  50.06,35.98 270 top
C21  23.81,35.8 90 top
C22  66.99,14.21 0 top
C23  33.97,23.73 90 top
C24  52.35,35.98 270 top
C25  56.52,27.55 0 top
C26  56.52,25.32 0 top
C27  63.09,37.12 90 top
C28  65.38,37.12 90 top
CN1  27,3.5 0 top
CN2  39,3.5 0 top
CN3  51,3.5 0 top
CP2102  60.96,14.84 90 top
D1  17.78,42.15 180 top
D2  69.85,42.15 180 top
D3  57.15,42.15 180 top
D4  43.81,42.15 180 top
D5  30.8,42.15 180 top
D6  89.22,42.47 0 top
D7  60.01,9.77 270 top
D8  67.94,9.77 90 top
D9  4.76,42.15 180 top
D10  86.68,42.47 0 top
D11  84.14,42.47 0 top
H2  95.8,45 0 top
H3  4.1,4.1 0 top
H4  95.8,4.1 0 top
IC1  13.02,35.8 0 top
J1  77,65 270 top
J2  64,65 270 top
J3  51,65 270 top
J4  38,65 270 top
J5  25,65 270 top
J6  12,65 270 top
J9  88,60 180 top
JP1  28,18 90 top
JP2  32.07,8.5 270 top
JP3  44.13,8.5 270 top
JP4  55.88,8.5 270 top
JP5  55.68,13.42 180 top
JP6  55.68,15.67 180 top
LED1  75.88,2.46 180 top
LOGO1  14.29,26.85 0 bottom
R1  86.68,45.33 90 top
R2  84.14,45.33 90 top
R3  61.59,45.33 180 top
R4  79.69,42.15 270 top
R5  74.61,45.33 180 top
R6  74.61,42.15 270 top
R7  74.61,45.33 180 top
R8  61.59,45.33 180 top
R9  48.58,45.33 180 top
R10  75.88,6.27 90 top
R11  64.14,42.15 270 top
R12  61.59,42.15 270 top
R13  51.12,42.15 270 top
R14  48.58,42.15 270 top
R15  38.1,42.15 270 top
R16  35.56,45.33 180 top
R17  35.56,42.15 270 top
R18  35.56,45.33 180 top
R19  72.07,42.15 270 top
R20  59.05,42.15 270 top
R21  27.62,42.15 270 top
R22  48.58,45.33 180 top
R23  22.54,42.15 270 top
R24  61.28,21.51 180 top
R25  46.04,42.15 90 top
R26  33.02,42.15 270 top
R27  31.43,23.73 270 top
R28  89.22,45.33 90 top
R29  22.54,45.33 180 top
R30  23.81,32.31 90 top
R31  21.27,32.31 270 top
R32  45.09,13.57 90 top
R33  14.32,18.73 0 top
R34  18.73,35.8 90 top
R35  21.27,35.8 90 top
R36  22.54,45.33 180 top
R37  20,42.15 270 top
R38  9.53,45.33 180 top
R39  9.53,45.33 180 top
R40  6.99,42.15 270 top
R41  14.61,42.15 270 top
R42  9.53,42.15 270 top
S3  81.92,31.99 90 top
SPI_EXT  71.25,18 90 top
TX_LINK4  52.91,8.42 270 top
TX_LINK5  40.95,8.42 270 top
TX_LINK6  28.89,8.5 270 top
U$4  2.17,9.38 0 top
U$5  97.79,63.11 0 top
U$7  2.22,58.34 0 top
U$13  16,7 0 top
U$14  83.19,16.75 0 top
UDPI  49.85,26.27 0 top
USB-C  68.58,5.95 0 top
X1  87,4.5 180 top
XTAL  61.34,26.97 0 top

### Tracks (layer width: path | path; a pad name or v marks a point on that pad's centre or on a via)
3.3V  (via drill 0.6 pad 0.5)
  Top 0.203: AVRDB.14 60.09,36.86 60.35,37.12 62.24,37.12 C27.1 | AVRDB.28 54.32,34.23 53.66,34.9 53.66,36.44 | AVRDB.42 58.09,29.15 57.61,28.66 56.38,28.66 55.66,27.95 C25.1
  Top 0.254: 53.66,36.44 53.27,36.83 C24.1 | C28.1 C27.1
  Top 0.305: U$13.2 12.82,18.09 R33.1 | 40.22,12.73 40.29,12.65
  Top 0.406: 61.59,41.07 R12.2 61.17,41.3 v60.33,42.15 | C24.1 C20.1 50.16,36.93 v50.16,38.02 | CN1.3 34,5.41 33.6,5.8 | 33.6,5.8 26.98,5.8 26.06,6.72 26.06,8.19 23,11.25 10.16,11.25 9.52,11.89 9.52,15.13 10.27,15.89 U$13.2 | 33.6,5.8 44.58,5.8 | CN2.3 46,4.38 44.58,5.8 | 44.58,5.8 57.14,5.8 | CN3.3 58,4.94 57.14,5.8 | IC1.3 7.83,35.16 C19.1 6.51,34.95 6.17,35.29 6.17,37.58 6.63,38.03 v7.77,38.03 8.1,37.7 IC1.1 | C28.1 65.44,36.21 v66.52,36.21 | 33.6,5.8 34.29,6.49 v34.29,9.23 | v34.29,12.62 35.46,12.62 C7.2 C6.2 40.22,12.73 40.32,12.62 AP2112.5 | v29.03,33.01 29.95,32.09 29.95,22.05 | 31.77,19.58 v31.77,19.52 | C10.1 93.98,12.69 v93.95,12.66 93.98,12.64 | 93.98,12.64 C16.1 | 93.98,12.64 91.3,12.64 U$14.VDD 91.06,12.62 88.58,12.62 85.09,9.13 73.66,9.13 73.03,9.77 v72.07,9.77 | v31.77,19.52 45.03,19.52 47.03,21.51 54.12,21.51 | 54.12,21.51 R24.2 | 54.12,21.51 55.66,23.06 C26.1 55.66,25.64 | C25.1 55.66,25.64 | UDPI.3 55.03,26.27 55.66,25.64 | R23.2 22.54,40.56 v23.18,39.93 | R6.2 v74.61,39.93 81.27,39.93 82.23,40.89 82.23,48.5 v82.87,49.14 | R14.2 48.16,41.3 v47.31,42.15 | v31.77,19.52 29.95,21.35 29.95,22.05 | JP1.5 29.71,21.81 29.95,22.05 | 29.95,22.05 30.79,22.88 R27.2 | v34.29,42.15 35.14,41.3 R17.2 | v18.73,39.93 v10.16,39.93 9.53,40.56 R42.2 | v62.23,6.59 61.44,5.8 57.14,5.8
  Bottom 0.406: 34.29,39.93 47.31,39.93 | 47.31,39.93 51.77,39.93 | 68.16,39.93 v74.61,39.93 | 34.29,39.93 30.44,39.93 | 30.44,39.93 v23.18,39.93 v18.73,39.93 | 30.44,39.93 28.88,38.37 ANALOG_EXPANDER.2 28.88,33.16 v29.03,33.01 | v50.16,38.02 50.16,38.33 51.77,39.93 | v66.52,36.21 66.52,38.29 68.16,39.93 | v34.29,9.23 v34.29,12.62 34.29,17 v31.77,19.52 | 93.99,12.62 v93.95,12.66 | v47.31,42.15 47.31,39.93 | J9.3 88.64,50.09 87.68,49.14 v82.87,49.14 | 51.77,39.93 60.33,39.93 | 60.33,39.93 68.16,39.93 | 60.33,39.93 v60.33,42.15 | 34.29,39.93 v34.29,42.15 | v7.77,38.03 9.66,39.93 v10.16,39.93 | v62.23,6.59 62.23,6.91 63.82,8.5 70.8,8.5 v72.07,9.77
+5V  (via drill 0.6 pad 0.5)
  Top 0.305: CP2102.7 63.01,12.9 | v63.45,11.91 63.01,12.35 63.01,12.9 | CP2102.8 63.01,12.9 | 45.03,12.68 45.09,12.62 R32.1 45.17,12.64
  Top 0.406: USB-C.A4/B9 66.18,7.5 65.19,8.5 v61.14,8.5 58.66,8.5 56.78,10.38 51.68,10.38 v49.37,12.69 49.33,12.73 C5.2 | v63.45,11.91 63.84,11.91 C22.1 66.14,16.54 v68.26,18.66 | R32.1 44.98,12.62 | J9.2 92,53.65 93.03,52.63 93.03,49.45 92.08,48.5 92.08,42.47 95.57,38.98 95.57,29.45 93.98,27.86 v78.42,27.86
  Top 0.508: C5.2 R32.1 | 44.98,12.62 AP2112.1
  Bottom 0.406: v63.45,11.91 63.45,10.81 v61.14,8.5 | v78.42,27.86 77.47,28.81 72.71,28.81 69.22,25.32 69.22,19.61 v68.26,18.66
AGND  (via drill 0.6, 0.6 pad 0.5)
  Top 0.203: AVRDB.29 53.96,33.84 53.62,34.17
  Top 0.254: C20.2 C24.2 | 52.35,34.77 C24.2 | 53.62,34.17 53.3,34.17 C24.2
  Top 0.305: C24.2 51.96,35.13 v51.21,34.38
  Top 0.406: v72.39,49.14 75.76,49.14 75.92,49.3 | 61.7,49.14 v59.37,49.14 | C19.2 7.83,36.44 IC1.2 12.34,36.44 13.03,35.75 13.03,33.9 | IC1.4 13.03,33.9 | 13.03,33.9 IC1.5 15.72,34.61 | IC1.6 15.72,34.61 | 15.72,34.61 16.06,34.95 R34.1 18.73,33.9 19.47,33.16 R31.1 | ANALOG_EXPANDER.1 25.44,36.65 C21.2 | D11.A v84.14,40.56 | D10.A v86.68,40.56 | D6.A v89.22,40.56 91.12,42.47 91.12,51.06 J9.1 | D1.A 16.94,42.9 v16.19,42.15 15.34,41.3 R41.2 C1.2 | C13.2 R21.2 28.36,41.3 v29.21,42.15 29.96,42.9 D5.A | R15.2 C12.2 41.38,41.3 v42.23,42.15 42.98,42.9 D4.A | R13.2 C8.2 54.4,41.3 v55.24,42.15 | v55.24,42.15 55.99,42.9 D3.A | R11.2 C2.2 67.41,41.3 v68.26,42.15 69.01,42.9 D2.A | C9.2 R4.2 80.11,41.3 v80.96,42.15 | v55.24,42.15 54.29,41.19 55.58,39.9 v55.58,38.95 | v7.3,49.14 9.59,49.14 J6.4 | J3.4 48.59,49.14 v46.35,49.14 | v20.32,49.14 22.59,49.14 J5.4 | v33.34,49.14 35.59,49.14 J4.4 | D9.A 4.45,43.22 v4.45,44.05
  Bottom 0.406: 67.31,49.14 v59.37,49.14 54.29,49.14 | 67.31,49.14 v72.39,49.14 77.8,49.14 80.96,45.97 v80.96,42.15 81.28,42.15 82.87,40.56 v84.13,40.56 v84.14,40.56 86.86,40.56 | 54.29,49.14 v46.35,49.14 41.27,49.14 | 15.24,49.14 v20.32,49.14 28.26,49.14 | v89.22,40.56 v86.68,40.56 | 51.21,34.61 v51.21,34.38 55.58,38.75 v55.58,38.95 | 28.26,49.14 v33.34,49.14 41.27,49.14 | 15.24,49.14 v7.3,49.14 4.76,49.14 4.13,48.5 4.13,44.37 v4.45,44.05 | 41.27,49.14 42.23,48.18 v42.23,42.15 | v29.21,42.15 29.21,48.18 28.26,49.14 | 15.24,49.14 16.19,48.18 v16.19,42.15 16.19,40.88 13.02,37.7 v13.02,35.8 | v55.24,42.15 55.24,48.18 54.29,49.14 | v68.26,42.15 68.26,48.18 67.31,49.14
  other vias: 18.73,32.31 13.02,32.31 15.56,50.72 94.93,51.04 94.93,54.53 91.59,39.5 15.88,32.31 4.13,38.66 4.76,32.31 15.24,57.39 27.94,57.39 41.91,57.39 54.61,57.39 67.31,57.39 81.28,56.12 91.12,56.12
  pour Top: -0.41,65.67 100.69,65.67 100.69,36.84 -0.41,36.84
  pour Bottom: -0.15,65 101.12,65 101.12,36.75 -0.15,36.75
  pour Top: -0.64,37.15 54.31,37.15 54.31,30.72 -0.64,30.72
  pour Bottom: 54.76,30.69 -0.79,30.69 -0.79,37.2 54.76,37.2
ANALOG_INPUT  (via drill 0.6 pad 0.5)
  Top 0.203: AVRDB.37 55.98,30.4 38.1,30.4 | v28.89,30.4 25.72,27.23 25.72,13.57 26.4,12.89 v26.52,12.89 | ANALOG_EXPANDER.4 33.97,35.74 33.97,34.53 38.1,30.4 | v31.11,30.4 38.1,30.4
  Top 0.254: TX_LINK4.1 51.63,8.83 49.12,11.35 30.8,11.35 v30.18,11.98 | U$13.8 21.95,15.89 24.95,12.89 v26.52,12.89
  Bottom 0.203: v26.52,12.89 29.26,12.89 | v31.11,30.4 v28.89,30.4
  Bottom 0.254: 29.26,12.89 v30.18,11.98
AVR_RX  (via drill 0.6 pad 0.5)
  Top 0.203: JP1.3 29.72,18.38 v53.03,18.38 | v53.26,14.49 54.51,13.25 55.1,13.25 JP5.2 | AVRDB.5 65.38,32.55 68.58,29.35 68.58,20.66 66.26,18.34 57.15,18.34 v56.83,18.02
  Bottom 0.203: v53.26,14.49 53.03,14.72 v53.03,18.38 56.53,18.38 56.88,18.02 v56.83,18.02
AVR_TX
  Top 0.203: JP1.2 29.72,15.83 29.72,17.23 30.18,17.69 46.56,17.69 48,16.25 51.25,16.25 51.75,15.75 55.19,15.75 | AVRDB.4 64.92,32.09 67.94,29.07 67.94,20.94 65.98,18.97 56.15,18.97 54.92,17.75 54.92,16.69 55.37,16.24 55.37,15.93 55.19,15.75 | 55.19,15.75 JP6.2
CT1
  Top 0.203: AVRDB.23 56.49,37.61 59.21,40.32 68.77,40.32 D2.K
  Top 0.305: 69.95,41.3 D2.K
  Top 0.406: R19.2 69.95,41.3
CT2
  Top 0.203: AVRDB.24 56.09,37.92 56.52,38.34 56.52,38.76 R20.2
  Top 0.305: D3.K 57.03,41.52
  Top 0.406: D3.K 57.25,41.3 R20.2
CT3
  Top 0.203: AVRDB.25 55.24,35.53 55.24,37.93 53.88,39.29 52.39,39.29 51.44,40.24 44.97,40.24 D4.K
  Top 0.406: R25.1 45.94,41.4 D4.K
CT4
  Top 0.203: AVRDB.26 54.89,35.03 54.61,35.32 54.61,37.73 53.68,38.66 51.97,38.66 51.02,39.61 34.15,39.61 33.02,40.74 R26.2
  Top 0.406: R26.2 30.9,41.3 D5.K
CT5  (via drill 0.6 pad 0.5)
  Top 0.203: AVRDB.30 49.86,33.44 48.96,34.34 48.96,37.64 v48.58,38.02 | v44.77,38.66 44.45,38.98 22.23,38.98 20,41.2 R37.2
  Top 0.305: 17.88,41.3 D1.K
  Top 0.406: R37.2 17.88,41.3
  Bottom 0.203: v44.77,38.66 45.09,38.98 47.62,38.98 v48.58,38.02
CT6  (via drill 0.6 pad 0.5)
  Top 0.203: AVRDB.31 49.38,33.03 48.26,34.15 48.26,36.44 46.99,37.7 v46.99,38.02 | v42.86,38.02 42.55,38.34 20.95,38.34 20.32,38.98 9.31,38.98 R40.2
  Top 0.406: R40.2 4.86,41.3 D9.K
  Bottom 0.203: v46.99,38.02 46.67,37.7 43.18,37.7 v42.86,38.02
CT7
  Top 0.203: AVRDB.32 48.57,32.63 46.67,34.53 46.67,35.74 ANALOG_EXPANDER.9
CT8
  Top 0.203: AVRDB.33 46.43,32.23 44.13,34.53 44.13,35.74 ANALOG_EXPANDER.8
CT9
  Top 0.203: AVRDB.34 44.29,31.84 41.59,34.53 41.59,35.74 ANALOG_EXPANDER.7
CT10
  Top 0.203: AVRDB.35 42.15,31.44 39.05,34.53 39.05,35.74 ANALOG_EXPANDER.6
CT11
  Top 0.203: AVRDB.36 40.01,31.03 36.51,34.53 36.51,35.74 ANALOG_EXPANDER.5
D+
  Top 0.203: CP2102.4 60.96,9.99 61.15,9.8 | USB-C.A6 68.33,7.65 67.49,8.5 66.67,8.5 65.72,9.45 61.51,9.45 61.15,9.8 | D7.K 60.8,9.8 61.15,9.8
D-
  Top 0.203: CP2102.5 61.45,10.58 61.94,10.09 66.57,10.09 67.21,9.46 | 67.21,9.46 68.83,7.84 USB-C.A7 | D8.K 67.21,9.75 67.21,9.46
DIG1
  Top 0.813: X1.ANTENNA 87,9.14 88.61,10.75 U$14.ANT
DIGITAL  (via drill 0.6 pad 0.5)
  Top 0.203: v52.25,16.75 52.39,16.75 52.64,17 53.49,17 56.1,19.61 65.7,19.61 67.31,21.22 67.31,28.79 64.47,31.63 AVRDB.3 | v39.13,8.77 39.19,8.83 TX_LINK5.1
  Bottom 0.203: v52.25,16.75 51.75,16.25 51.75,12.98 47.55,8.77 v39.13,8.77
DS18B20  (via drill 0.6 pad 0.5)
  Top 0.203: SPI_EXT.1 70.66,12.24 70.42,12.24 69.85,12.82 69.85,29.91 66.29,33.46 AVRDB.8
  Top 0.254: 31.38,10.08 32,9.46 32,8.96 JP2.1 | 31.38,10.08 26.58,10.08 23.81,12.85 v23.81,12.94 | v61.28,7.14 58.97,7.14 v58.74,6.91 56.74,8.9 JP4.1 | v23.81,17.07 22.15,18.73 R33.2 15.17,16.09 U$13.4 | 31.38,10.08 43.5,10.08 44.13,9.45 JP3.1 49.66,8.9 v49.78,8.77
  Top 0.406: R33.2 15.24,18.66
  Bottom 0.254: SPI_EXT.1 70.3,10.7 64.84,10.7 v61.28,7.14 | v58.74,6.91 56.87,8.77 v49.78,8.77 | v23.81,12.94 v23.81,17.07
DTR  (via drill 0.6, 0.6 pad 0.5)
  Top 0.203: JP1.1 30.4,13.98 30.4,16.55 30.86,17 v37.72,17 45.95,17 47.32,15.63 50.29,15.63 53.95,11.98 57.09,11.98 CP2102.28 | C23.1 v33.97,20.56
  Bottom 0.203: v37.72,17 37.53,17 v33.97,20.56
GND  (via drill 0.6 pad 0.5)
  Top 0.203: AVRDB.15 59.69,37.15 | AVRDB.43 58.49,28.86
  Top 0.254: 60.46,11.57 CP2102.3 60.46,14.34 | 60.35,37.81 59.69,37.15 | C25.2 57.37,27.73 58.49,28.86 | XTAL.4 XTAL.2 | C27.2 63.18,37.89 63.32,37.74 | 65.15,37.74 65.3,37.89 | 32.22,14.43 v32.16,14.49 | v59.37,31.99 59.21,31.83 59.21,32.31 AVRDB.49 | AVRDB.49 59.27,34.21 v59.37,34.21 | AVRDB.49 57.31,34.21 v57.15,34.21 | AVRDB.49 58.29,33.13 v57.15,31.99
  Top 0.305: USB-C.GND1 64.96,6.66 USB-C.A1/B12 | 60.46,11.57 59.98,11.09 | CP2102.EXP 60.46,14.34 | C6.1 38.52,14.43 39.32,13.63 41.6,13.63 | 41.6,13.57 AP2112.2 | C17.2 62.51,26.06 XTAL.2 62.44,24.37 C15.2 | C25.2 C26.2
  Top 0.406: C6.1 C7.1 32.22,14.43 | 86.36,33.97 86.87,33.46 86.68,33.26 S3.2 S3.1 | C22.2 C18.2 | C18.2 67.84,11.76 | C18.2 67.84,11.11 68.69,10.26 D8.A 70.37,8.09 71.55,8.09 71.78,7.86 USB-C.B1/A12 | USB-C.B1/A12 | U$13.1 U$13.3 U$13.5 | USB-C.GND3 73.23,1.46 75.84,1.46 LED1.C 75.93,1.46 83.96,1.46 X1.GND2 | X1.GND3 91.53,7.04 93.98,9.49 C16.2 94.04,9.55 95.56,11.06 95.56,14.72 94.58,15.7 C10.2 93.34,15.7 92.4,14.75 U$14.GND | 41.6,13.57 41.6,13.63 41.6,15.4 42.06,15.86 45.72,15.86 47.09,14.49 47.56,14.49 C5.1 47.69,14.49 v49.38,14.49 52.58,11.29 58.29,11.29 v58.52,11.06 | USB-C.B1/A12 72.21,6.66 USB-C.GND2 | C26.2 57.37,23.88 v58.29,22.95 64.47,22.95 64.92,23.41 64.92,25.91 C17.2 | v58.52,11.06 58.86,11.4 CP2102.M | 59.98,11.09 59.95,11.06 v58.52,11.06 | D7.A 58.52,10.5 v58.52,11.06 | 65.3,37.89 66.49,37.89 68.49,35.89 | C28.2 65.3,37.89 | 65.3,37.89 63.18,37.89 | C27.2 62.93,37.81 60.35,37.81 | U$14.P$12 77.12,10.75 v77.15,10.72
  Top 0.813: X1.GND4 X1.GND2 X1.GND1 X1.GND3
  Top 1.27: 86.36,33.97 86.36,34.94
  Bottom 0.406: CN3.1 51,2.55 49.91,1.46 | U$13.5 16.64,5.63 20.8,1.46 26.98,1.46 | 26.98,1.46 37.95,1.46 | CN1.1 26.98,3.48 26.98,1.46 | CN2.1 39,2.51 37.95,1.46 | 49.91,1.46 63.94,1.46 USB-C.GND4 | USB-C.GND4 64.58,1.46 72.59,1.46 USB-C.GND3 USB-C.GND2 | v58.52,11.06 58.52,8.37 61.25,5.64 63.94,5.64 USB-C.GND1 USB-C.GND4 | v32.16,14.49 30.18,16.47 30.18,23.41 29.31,24.27 JP1.6 | v58.29,22.95 55.55,22.95 | 55.55,22.95 49.38,16.77 v49.38,14.49 | UDPI.1 47.31,24.37 48.73,22.95 55.55,22.95 | 49.91,1.46 37.95,1.46 | v78.38,7.2 77.15,8.43 v77.15,10.72
  other vias: 60.96,14.84 93.98,33.9 81.88,33.87 81.88,30.69 42.82,26.25 42.82,22.12 65.05,17.04 65.05,23.07 10.76,22.76 20.6,22.76 81.24,7.2 81.24,4.34 19,9.5 67.91,16.09 93.98,31.35 89.53,31.35 93.98,26.27 93.98,17.38 92.04,8.47 14,9.5
  pour Top (isolate 0.305): 56.52,36.12 100.37,36.12 100.37,29.77 56.52,29.77
  pour Bottom (isolate 0.305): -0.65,29.87 76.66,29.87 76.66,-0.18 -0.65,-0.18
  pour Top (isolate 0.305): -0.83,29.77 76.66,29.77 76.66,-0.6 -0.83,-0.6
  pour Top (isolate 0.305): 89.52,29.67 101.31,29.67 101.31,-0.39 89.52,-0.39
  pour Bottom (isolate 0.305): 56.18,36.12 100.38,36.12 100.38,29.77 56.18,29.77
  pour Top (isolate 0.305): 76.82,10.08 89.67,10.08 89.67,-0.39 76.82,-0.39
  pour Bottom (isolate 0.305): 76.5,10.18 89.67,10.18 89.67,-0.18 76.5,-0.18
  pour Bottom (isolate 0.305): 76.5,29.87 89.36,29.87 89.36,23.32 76.5,23.32
  pour Bottom (isolate 0.305): 89.52,29.87 100.15,29.87 100.15,-0.18 89.52,-0.18
GND1
  pour Top (isolate 0.305): 87.61,37.7 94.03,37.7 94.03,35.16 87.61,35.16
GND2
  pour Bottom (isolate 0.305): 87.61,37.7 94.03,37.7 94.03,35.16 87.61,35.16
LED
  Top 0.203: R10.2 74.82,7.12 73.48,8.46 72.75,8.46 72.39,8.81 71.44,8.81 69.27,10.98 69.27,29.58 65.84,33.01 AVRDB.6
N$1
  Top 0.305: R32.2 44.98,14.52 AP2112.3
N$2
  Top 0.406: R40.1 6.99,45.01 6.67,45.33 R38.2
  Top 1.27: J6.2 5.3,45.74 R38.2 R39.2
N$3
  Top 0.406: R9.2 46.35,45.33 46.04,45.01 R25.2
  Top 1.27: R9.2 R22.2 44.45,45.64 44.45,53.05 J3.2
N$4
  Top 0.305: CP2102.6 61.96,11.41 62.5,10.87 64.67,10.87 65.97,12.16
  Top 0.406: C18.1 65.97,12.16
N$5
  Top 0.406: R42.1 C1.1 | R41.1 C1.1 | C1.1 12.06,45.01 11.75,45.33 R39.1 | C1.1
  Top 1.27: J6.1 5.3,60.34 8.26,57.39 10.79,57.39 13.34,54.85 R38.1 R39.1
N$6
  Top 0.406: C21.1 23.81,34.85 | 23.81,34.85 R30.2 | R35.1 23.71,34.95 23.81,34.85
N$8
  Top 0.406: R26.1 33.02,44.91 33.44,45.33 R18.2
  Top 1.27: R18.2 R16.2 31.3,45.77 J4.2
N$10
  Top 0.305: 71.12,45.33 70.96,45.17 R5.2
  Top 0.406: R7.2 72.71,45.33 72.07,44.69 R19.1
  Top 1.27: R7.2 71.12,45.33 R5.2 70.48,45.64 70.48,53.02 J1.2
N$11
  Top 0.406: R6.1 C9.1 | C9.1 R4.1 | R5.1 77.47,45.33 77.15,45.01 C9.1
  Top 1.27: R7.1 R5.1 78.42,54.53 75.56,57.39 72.71,57.39 70.3,59.8 J1.1
N$12
  Top 0.406: R36.2 20.17,45.33 20,45.16 R37.1
  Top 1.27: J5.2 18.3,45.76 R29.2 R36.2
N$13
  Top 0.406: R8.2 59.37,45.33 59.05,45.01 R20.1
  Top 1.27: R8.2 R3.2 57.47,45.64 57.47,53.03 J2.2
N$18  (via drill 0.6 pad 0.5)
  Top 0.254: v30.48,6.91 30.48,7.78 | 30.48,7.78 30.18,8.08 TX_LINK6.2 | JP2.2 30.79,8.09 30.48,7.78
  Bottom 0.254: CN1.2 30.48,3.52 v30.48,6.91
  Bottom 0.406: CN1.2 30.48,3.52
N$19  (via drill 0.6 pad 0.5)
  Top 0.254: v42.33,6.72 42.33,7.63 | 42.33,7.63 42.33,7.86 42.18,8.01 TX_LINK5.2 | JP3.2 42.79,8.09 42.33,7.63
  Bottom 0.254: CN2.2 42.33,3.67 v42.33,6.72
N$21  (via drill 0.6 pad 0.5)
  Top 0.254: 54.48,7.86 v54.48,6.72 | TX_LINK4.2 54.33,8.01 54.48,7.86 | JP4.2 54.71,8.09 54.48,7.86
  Bottom 0.254: CN3.2 54.48,3.52 v54.48,6.72
N$24
  Top 0.406: R12.1 R11.1 | R11.1 C2.1 | R3.1 64.14,45.33 R11.1
  Top 1.27: R8.1 R3.1 65.41,54.53 62.55,57.39 59.69,57.39 57.3,59.78 J2.1
N$25
  Top 0.406: R14.1 R13.1 | R13.1 C8.1 | R22.1 51.44,45.33 51.12,45.01 R13.1
  Top 1.27: R9.1 R22.1 52.39,54.85 49.85,57.39 46.67,57.39 44.3,59.76 J3.1
N$26
  Top 0.406: R16.1 38.42,45.33 38.1,45.01 R15.1 | R15.1 C12.1 | R17.1 R15.1
  Top 1.27: R18.1 R16.1 39.37,54.85 36.83,57.39 33.66,57.39 31.3,59.75 J4.1
N$27
  Top 0.406: IC1.8 IC1.7 15.93,36.65 R34.2 R35.2
N$28
  Top 0.406: 25.08,43.1 C13.1 R21.1 | 25.08,43.1 25.08,45.17 25.24,45.33 R29.1 | R23.1 24.98,43 25.08,43.1
  Top 1.27: R36.1 R29.1 26.35,54.53 23.5,57.39 20.64,57.39 18.3,59.73 J5.1
N$41
  Top 0.305: R10.1 LED1.A
PULSE_INPUT  (via drill 0.6 pad 0.5)
  Top 0.203: v51.12,17.07 51.55,17.5 53.25,17.5 55.99,20.24 65.41,20.24 66.67,21.5 66.67,28.51 64.01,31.18 AVRDB.2 | v47.32,10.38 46.98,10.72 30.06,10.72 v29.95,10.83
  Top 0.254: U$13.6 17.91,16.92 18.68,17.7 21.64,17.7 24.77,14.57 v24.77,14.53 | v27.2,9 28.8,9 TX_LINK6.1
  Bottom 0.203: v51.12,17.07 51.12,13.03 48.46,10.38 v47.32,10.38 | v29.95,10.83 28.12,9 v27.2,9
  Bottom 0.254: v24.77,14.53 24.77,11.44 v27.2,9
RESET
  Top 0.203: AVRDB.40 57.29,29.72 57.15,29.58 38.47,29.58 33.73,24.83 C23.2 R27.1
RFM_MISO
  Top 0.203: SPI_EXT.5 72.19,22.75 U$14.SDO 75.19,27.31 67.67,34.84 AVRDB.11
RFM_MOSI  (via drill 0.6 pad 0.5)
  Top 0.203: U$14.SDI 92.49,18.75 94.3,20.56 94.3,24.33 91.72,26.91 77.79,26.91 v76.83,27.86 76.68,27.86 | v72.69,25.92 72.69,28.89 67.21,34.38 AVRDB.10
  Bottom 0.203: v76.83,27.86 74.87,27.86 72.96,25.96 72.73,25.96 v72.69,25.92 72.69,25.8 SPI_EXT.6
  Bottom 0.406: SPI_EXT.6
RFM_SCK  (via drill 0.6 pad 0.5)
  Top 0.203: U$14.SCK 92.58,20.75 93.34,21.51 93.34,23.73 91.12,25.96 v77.47,25.96 68.14,35.29 AVRDB.12
  Bottom 0.203: v77.47,25.96 74.11,25.96 72.69,24.55 72.69,20.72 SPI_EXT.4
  Bottom 0.406: SPI_EXT.4
RFM_SEL  (via drill 0.6, 0.6 pad 0.5)
  Top 0.203: v73.98,24.69 72.73,24.69 71.33,26.09 71.33,29.35 66.75,33.92 AVRDB.9 | v78.74,24.69 90.16,24.69 91.19,23.66 U$14.SEL
  Top 0.254: v64.47,21.12 64.07,21.51 R24.1
  Bottom 0.203: v78.74,24.69 v73.98,24.69 73.38,24.09 73.38,18.86 SPI_EXT.3
  Bottom 0.254: SPI_EXT.3 68.85,16.73 v64.47,21.12
SWITCH1  (via drill 0.6 pad 0.5)
  Top 0.203: S3.4 75.29,30.72 v73.48,32.52 | AVRDB.48 60.95,29.83 64.22,29.83 v64.69,29.35
  Bottom 0.203: v64.69,29.35 64.82,29.35 68,32.52 v73.48,32.52
SWITCH2  (via drill 0.6 pad 0.5)
  Top 0.203: S3.3 76.89,33.67 v72.34,33.67 | AVRDB.1 61.76,31.03 v62.18,30.62
  Bottom 0.203: v62.18,30.62 64.03,30.62 67.08,33.67 v72.34,33.67
UDPI
  Top 0.203: AVRDB.41 57.69,29.43 57.38,29.12 51.42,29.12 49.85,27.55 UDPI.2
USB_RXD
  Top 0.254: CP2102.25 56.91,14.84 JP6.1
USB_TXD
  Top 0.254: CP2102.26 56.85,14.34 56.09,13.58
  Top 0.305: 56.09,13.58 JP5.1
VREFA
  Top 0.203: AVRDB.27 54.61,34.63 54.18,35.06 54.18,37.26 53.42,38.02 51.65,38.02 50.7,38.98 46.67,38.98 45.4,37.7 44.13,37.7 43.5,37.07 42.23,37.07 41.59,37.7 33.34,37.7 31.47,35.84 | 31.47,35.8 ANALOG_EXPANDER.3
  Top 0.406: 31.47,35.84 31.47,35.8 31.47,35.22 30.4,34.15 27.88,34.15 25.18,31.46 R30.1 R31.2
VS1  (via drill 0.6 pad 0.5)
  Top 0.254: v88.27,48.5 89.22,47.55 R28.2
  Bottom 0.254: v88.27,48.5 87.95,48.18 82.23,48.18 81.6,48.82 81.6,52.63 82.55,53.58 84.75,53.58 J9.6
VS2
  Top 0.254: J9.5 86.68,50.53 R1.2
VS3
  Top 0.254: J9.4 87.31,53.7 87.31,54.85 86.68,55.48 83.82,55.48 82.87,54.53 82.87,51.99 84.14,50.72 R2.2
VSENS1
  Top 0.203: AVRDB.20 57.69,36.75 59.89,38.95 67.67,38.95 69.04,37.58 85.28,37.58 88.27,40.56 88.27,42.15 89.22,43.1 D6.K
  Top 0.254: R28.1 D6.K
VSENS2
  Top 0.203: AVRDB.21 57.29,37.03 59.66,39.41 67.89,39.41 69.27,38.03 83.2,38.03 85.72,40.56 85.72,42.15 86.68,43.1 D10.K
  Top 0.254: R1.1 D10.K
VSENS3
  Top 0.203: AVRDB.22 56.89,37.32 59.44,39.86 68.12,39.86 69.49,38.49 81.43,38.49 83.19,40.24 83.19,42.15 84.14,43.1 D11.K
  Top 0.254: R2.1 D11.K
XTALHF1
  Top 0.203: AVRDB.44 58.89,29.37 59.12,29.14 59.12,26.46 59.46,26.12 XTAL.1
  Top 0.305: XTAL.1 60.24,24.24 C15.1
XTALHF2
  Top 0.203: AVRDB.45 59.29,29.49 59.89,28.89 61.95,28.89 62.44,28.4 XTAL.3
  Top 0.305: XTAL.3 62.51,27.76 C17.1
(copper drawn outside any net)
  shapes: Top area x1

### Text on the board
Bottom: OpenEnergyMonitor.org
tPlace: CT / 6 | CT / 5 | CT / 4 | CT / 3 | CT / 2 | CT / 1 | VOLTAGE SENSOR | RJ11: / 1 GND / 2 5V / 3 3.3 / 4 VS3 / 5 VS2 / 6 VS1 | RADIO ID SELECT | 3.3V | VREFA | CT / 12 | CT / 11 | CT / 10 | CT / 9 | CT / 8 | CT / 7 | GND | OpenEnergyMonitor.org | emonTx | energy monitor | GND | 3.3V | MOSI | V4.0.3 | GND | 3.3V | MISO | UART_EXT | SCK | TX | SEL | RX | RJ45: / 1 GND / 2 3.3V / 3 GND / 4 DS18B20 / 5 GND / 6 PULSE / 7 N/C / 8 ADC | DTR | TMP | PULSE | TMP | DIG | TMP | ADC | TMP | 3.3V | 3.3V | 3.3V
bPlace: Designed in | North Wales / Made in UK | Open-Hardware | emonTx | wireless energy monitoring node | Technology that helps us live within ecological limits | OpenEnergyMonitor.org | Lead free PCB - RoHS components
tNames: RFM69CW | GND | Data | GND | Data | GND | Data | U$13 | USBC
_tsilk: Designed in | North Wales | Made in UK
_bsilk: SMT V0.6 rev3 | emonTx | wireless energy monitoring node | SMT V0.6 rev3 | emonTx | SMT V0.6 rev3 | emonTx | Technology that helps us live within ecological limits | wireless energy monitoring node | wireless energy monitoring node | Designed in North Wales UK by Glyn Hudson & Trystan Lea | Technology that helps us live within ecological limits | Technology that helps us live within ecological limits | Designed in North Wales UK by Glyn Hudson & Trystan Lea | 165mm ant | 433Mhz | Designed in North Wales UK by Glyn Hudson & Trystan Lea | 165mm ant | 165mm ant | 433Mhz | 433Mhz | 868Mhz | 82mm ant | 82mm ant | 82mm ant | 868Mhz | 868Mhz | 78mm ant | 915Mhz | 78mm ant | 915Mhz | 78mm ant | 915Mhz | 165mm ant | 433Mhz | 82mm ant | 868Mhz | 78mm ant | 915Mhz